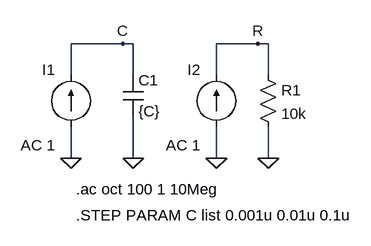
[diagram p0: schematic Fig_6-5_AC_Current-R-XC_sweep.asc]
Fig_6-5_AC_Current-R-XC_sweep.asc, the LTspice schematic file:
Version 4
SHEET 1 880 680
WIRE 176 96 96 96
WIRE 192 96 176 96
WIRE 384 96 320 96
WIRE 400 96 384 96
WIRE 96 144 96 96
WIRE 192 144 192 96
WIRE 320 144 320 96
WIRE 400 144 400 96
WIRE 96 272 96 224
WIRE 192 272 192 208
WIRE 320 272 320 224
WIRE 400 272 400 224
FLAG 400 272 0
FLAG 96 272 0
FLAG 320 272 0
FLAG 192 272 0
FLAG 176 96 C
FLAG 384 96 R
SYMBOL res 384 128 R0
SYMATTR InstName R1
SYMATTR Value 10k
SYMBOL current 96 224 R180
WINDOW 0 24 88 Left 2
WINDOW 3 24 0 Left 2
WINDOW 123 24 -28 Left 2
WINDOW 39 0 0 Left 2
SYMATTR InstName I1
SYMATTR Value ""
SYMATTR Value2 AC 1
SYMBOL current 320 224 R180
WINDOW 0 24 88 Left 2
WINDOW 3 24 0 Left 2
WINDOW 123 24 -28 Left 2
WINDOW 39 0 0 Left 2
SYMATTR InstName I2
SYMATTR Value ""
SYMATTR Value2 AC 1
SYMBOL cap 176 144 R0
SYMATTR InstName C1
SYMATTR Value {C}
TEXT 104 320 Left 2 !.ac oct 100 1 10Meg
TEXT 104 360 Left 2 !.STEP PARAM C list 0.001u 0.01u 0.1u

The netlist it stands for:
* Fig_6-5_AC_Current-R-XC_sweep.asc
R1 R 0 10k
I1 0 C AC 1
I2 0 R AC 1
C1 C 0 {C}
.ac oct 100 1 10Meg
.STEP PARAM C list 0.001u 0.01u 0.1u
.backanno
.end